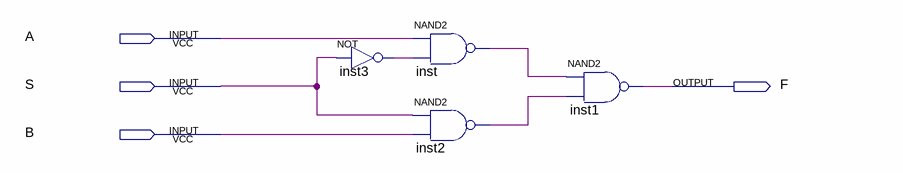
[diagram p0: schematic sheet]
// Quartus schematic 2to1MUX.bdf as structural Verilog: 4 symbols, 4 pins
module \2to1MUX  (
  input  A,
  input  S,
  input  B,
  output F
);

  wire inst2_out, inst3_out, inst_out;

  not inst3 (inst3_out, S);
  nand inst (inst_out, A, inst3_out);
  nand inst2 (inst2_out, S, B);
  nand inst1 (F, inst_out, inst2_out);
endmodule
